# EAGLE design STM32F030 (EAGLE 8.0.0)
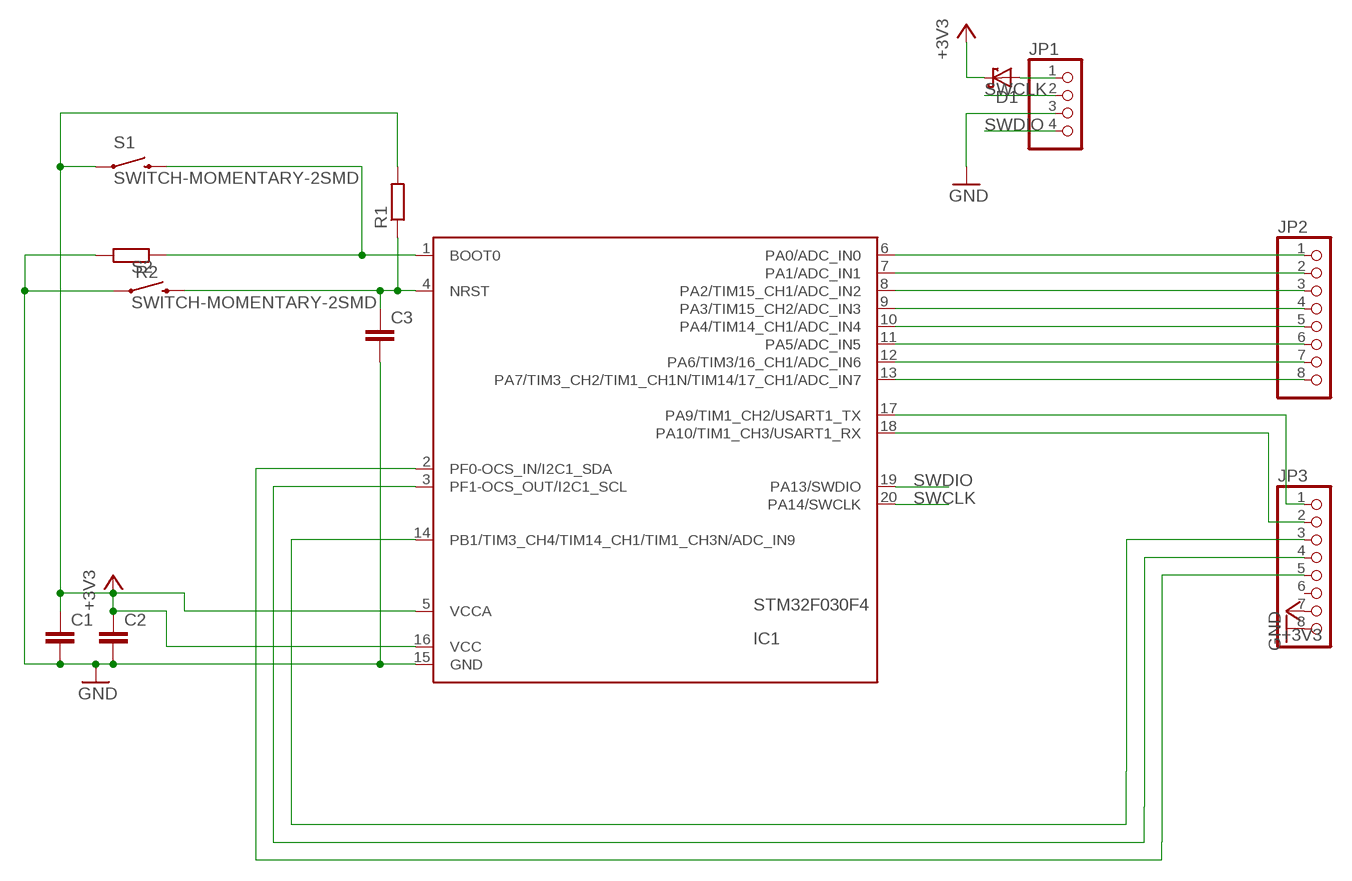
[diagram p0: schematic, sheet 1]

## Parts
C1  CAP_0805  [C0805]
C2  CAP_0805  [C0805]
C3  CAP_0805  [C0805]
D1  DIODE-SH_SOD523  [SOD523]
IC1  STM32F030F4  [TSSOP20]
JP1  PINHD-1X4  [1X04]
JP2  PINHD-1X8  [1X08]
JP3  PINHD-1X8  [1X08]
R1  R_0805  [R0805]
R2  R_0805  [R0805]
S1  SWITCH-MOMENTARY-2SMD  [TACTILE-SWITCH-SMD]
S2  SWITCH-MOMENTARY-2SMD  [TACTILE-SWITCH-SMD]

## Nets
+3V3: C1.1 C2.1 D1.C IC1.5(VCCA) IC1.16(VCC) JP3.7 R1.2 S1.1
GND: C1.2 C2.2 C3.2 IC1.15(GND) JP1.3 JP3.8 R2.2 S2.1
N$1: D1.A JP1.1
N$2: IC1.6(PA0/ADC_IN0) JP2.1
N$3: IC1.7(PA1/ADC_IN1) JP2.2
N$4: C3.1 IC1.4(NRST) R1.1 S2.3
N$5: IC1.1(BOOT0) R2.1 S1.3
N$6: IC1.8(PA2/TIM15_CH1/ADC_IN2) JP2.3
N$7: IC1.9(PA3/TIM15_CH2/ADC_IN3) JP2.4
N$8: IC1.10(PA4/TIM14_CH1/ADC_IN4) JP2.5
N$9: IC1.11(PA5/ADC_IN5) JP2.6
N$10: IC1.12(PA6/TIM3/16_CH1/ADC_IN6) JP2.7
N$11: IC1.13(PA7/TIM3_CH2/TIM1_CH1N/TIM14/17_CH1/ADC_IN7) JP2.8
N$12: IC1.17(PA9/TIM1_CH2/USART1_TX) JP3.1
N$13: IC1.18(PA10/TIM1_CH3/USART1_RX) JP3.2
N$14: IC1.2(PF0-OCS_IN/I2C1_SDA) JP3.5
N$15: IC1.3(PF1-OCS_OUT/I2C1_SCL) JP3.4
N$16: IC1.14(PB1/TIM3_CH4/TIM14_CH1/TIM1_CH3N/ADC_IN9) JP3.3
SWCLK: IC1.20(PA14/SWCLK) JP1.2
SWDIO: IC1.19(PA13/SWDIO) JP1.4
Unconnected: JP3.6

## Library data of the parts
C1-C3 = Namenlos:CAP_
D1 = Namenlos:DIODE-SH_
IC1 = Namenlos:STM32F030F4
JP1 = pinhead:PINHD-1X4: PIN HEADER
JP2 JP3 = pinhead:PINHD-1X8: PIN HEADER
R1 R2 = Namenlos:R_
S1 S2 = SparkFun-Electromechanical:SWITCH-MOMENTARY-2: Various NO switches- pushbuttons, reed, etc; PROD_ID: SWCH-08247

## Board
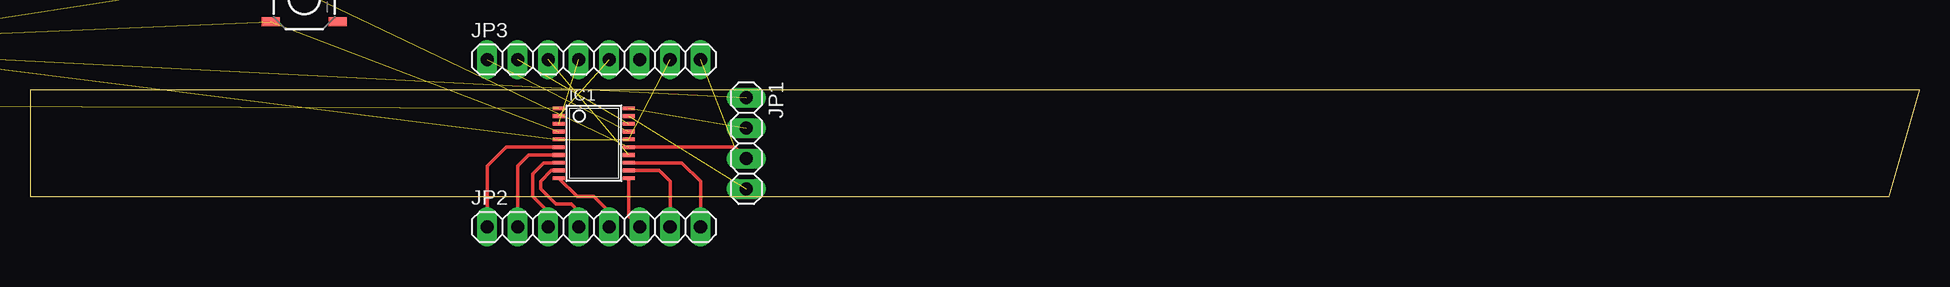
[diagram p1: board, top side]

Size 157.48 x 8.89 mm. Coordinates in mm from the lower left corner, seen from the top.
Outline: 0,0 154.94,0 157.48,8.89 0,8.89 0,0
Copper layers (1*16): Top 0.035mm / dielectric 1.5mm / Bottom 0.035mm
Design rules "default": minimum track width 10mil, minimum drill 24mil, track to track 8mil, track to pad 8mil, pad to pad 8mil, via to via 8mil, smd to smd 8mil, copper to edge 40mil, drill to drill 8mil, minimum pad ring 10mil, minimum via ring 8mil, stop-mask expansion 4mil, vias tented up to drill 0mil, thermal gap 10mil

### Footprints (pad centres in the part's own frame; a part is rotated, then mirrored left to right if it is on the bottom)
C0805 = smd 1.05 x 1.3: 1 -1.175,0; 2 1.175,0
SOD523 = smd 0.7 x 0.5: A 0.7,0; C -0.6,0
TSSOP20 = smd 0.305 x 0.991: 1 -2.925,-2.918; 2 -2.275,-2.918; 3 -1.625,-2.918; 4 -0.975,-2.918; 5 -0.325,-2.918; 6 0.325,-2.918; 7 0.975,-2.918; 8 1.625,-2.918; 9 2.275,-2.918; 10 2.925,-2.918; 11 2.925,2.918; 12 2.275,2.918; 13 1.625,2.918; 14 0.975,2.918; 15 0.325,2.918; 16 -0.325,2.918; 17 -0.975,2.918; 18 -1.625,2.918; 19 -2.275,2.918; 20 -2.925,2.918
1X04 = drill 1.1 long: 1 -3.81,0; 2 -1.27,0; 3 1.27,0; 4 3.81,0
1X08 = drill 1.1 long: 1 -8.89,0; 2 -6.35,0; 3 -3.81,0; 4 -1.27,0; 5 1.27,0; 6 3.81,0; 7 6.35,0; 8 8.89,0
R0805 = smd 1.05 x 1.3: 1 -1.175,0; 2 1.175,0
TACTILE-SWITCH-SMD = smd 1.524 x 0.762: 1 -2.794,1.905; 2 2.794,1.905; 3 -2.794,-1.905; 4 2.794,-1.905

### Placement (x,y rotation side)
C1  -39.37,7.62 0 top  (outside the outline)
C2  -17.78,12.7 0 top  (outside the outline)
C3  -22.86,12.7 0 top  (outside the outline)
D1  -27.94,12.7 0 top  (outside the outline)
IC1  46.99,4.45 270 top
JP1  59.69,4.45 270 top
JP2  46.99,-2.54 0 top
JP3  46.99,11.43 0 top
R1  -29.21,7.62 0 top  (outside the outline)
R2  -34.29,7.62 0 top  (outside the outline)
S1  -35.56,2.54 0 top  (outside the outline)
S2  22.86,16.51 0 top  (outside the outline)

### Tracks (layer width: path | path; a pad name or v marks a point on that pad's centre or on a via)
+3V3  (7 unrouted)
GND  (6 unrouted)
  Top 0.305: IC1.15 58.74,4.12 JP1.3
N$1  (1 unrouted)
N$2
  Top 0.305: IC1.6 39.68,4.12 38.1,2.54 JP2.1
N$3
  Top 0.305: IC1.7 41.57,3.47 40.64,2.54 JP2.2
N$4  (3 unrouted)
N$5  (2 unrouted)
N$6
  Top 0.305: IC1.8 42.83,2.82 41.91,1.91 41.91,0 43.18,-1.27 JP2.3
N$7
  Top 0.305: IC1.9 43.45,2.17 42.55,1.27 42.55,0.64 43.81,-0.63 45.09,-0.63 45.72,-1.27 JP2.4
N$8
  Top 0.305: JP2.5 48.26,-1.27 46.99,0 45.59,0 IC1.10
N$9
  Top 0.305: IC1.11 49.91,-1.65 JP2.6
N$10
  Top 0.305: IC1.12 52.44,2.17 53.34,1.27 JP2.7
N$11
  Top 0.305: IC1.13 54.33,2.82 55.88,1.27 JP2.8
N$12  (1 unrouted)
N$13  (1 unrouted)
N$14  (1 unrouted)
N$15  (1 unrouted)
N$16  (1 unrouted)
SWCLK  (1 unrouted)
SWDIO  (1 unrouted)